# Altium schematic sheet DDR3 Memory_SO-DIMM.SchDoc
size A3
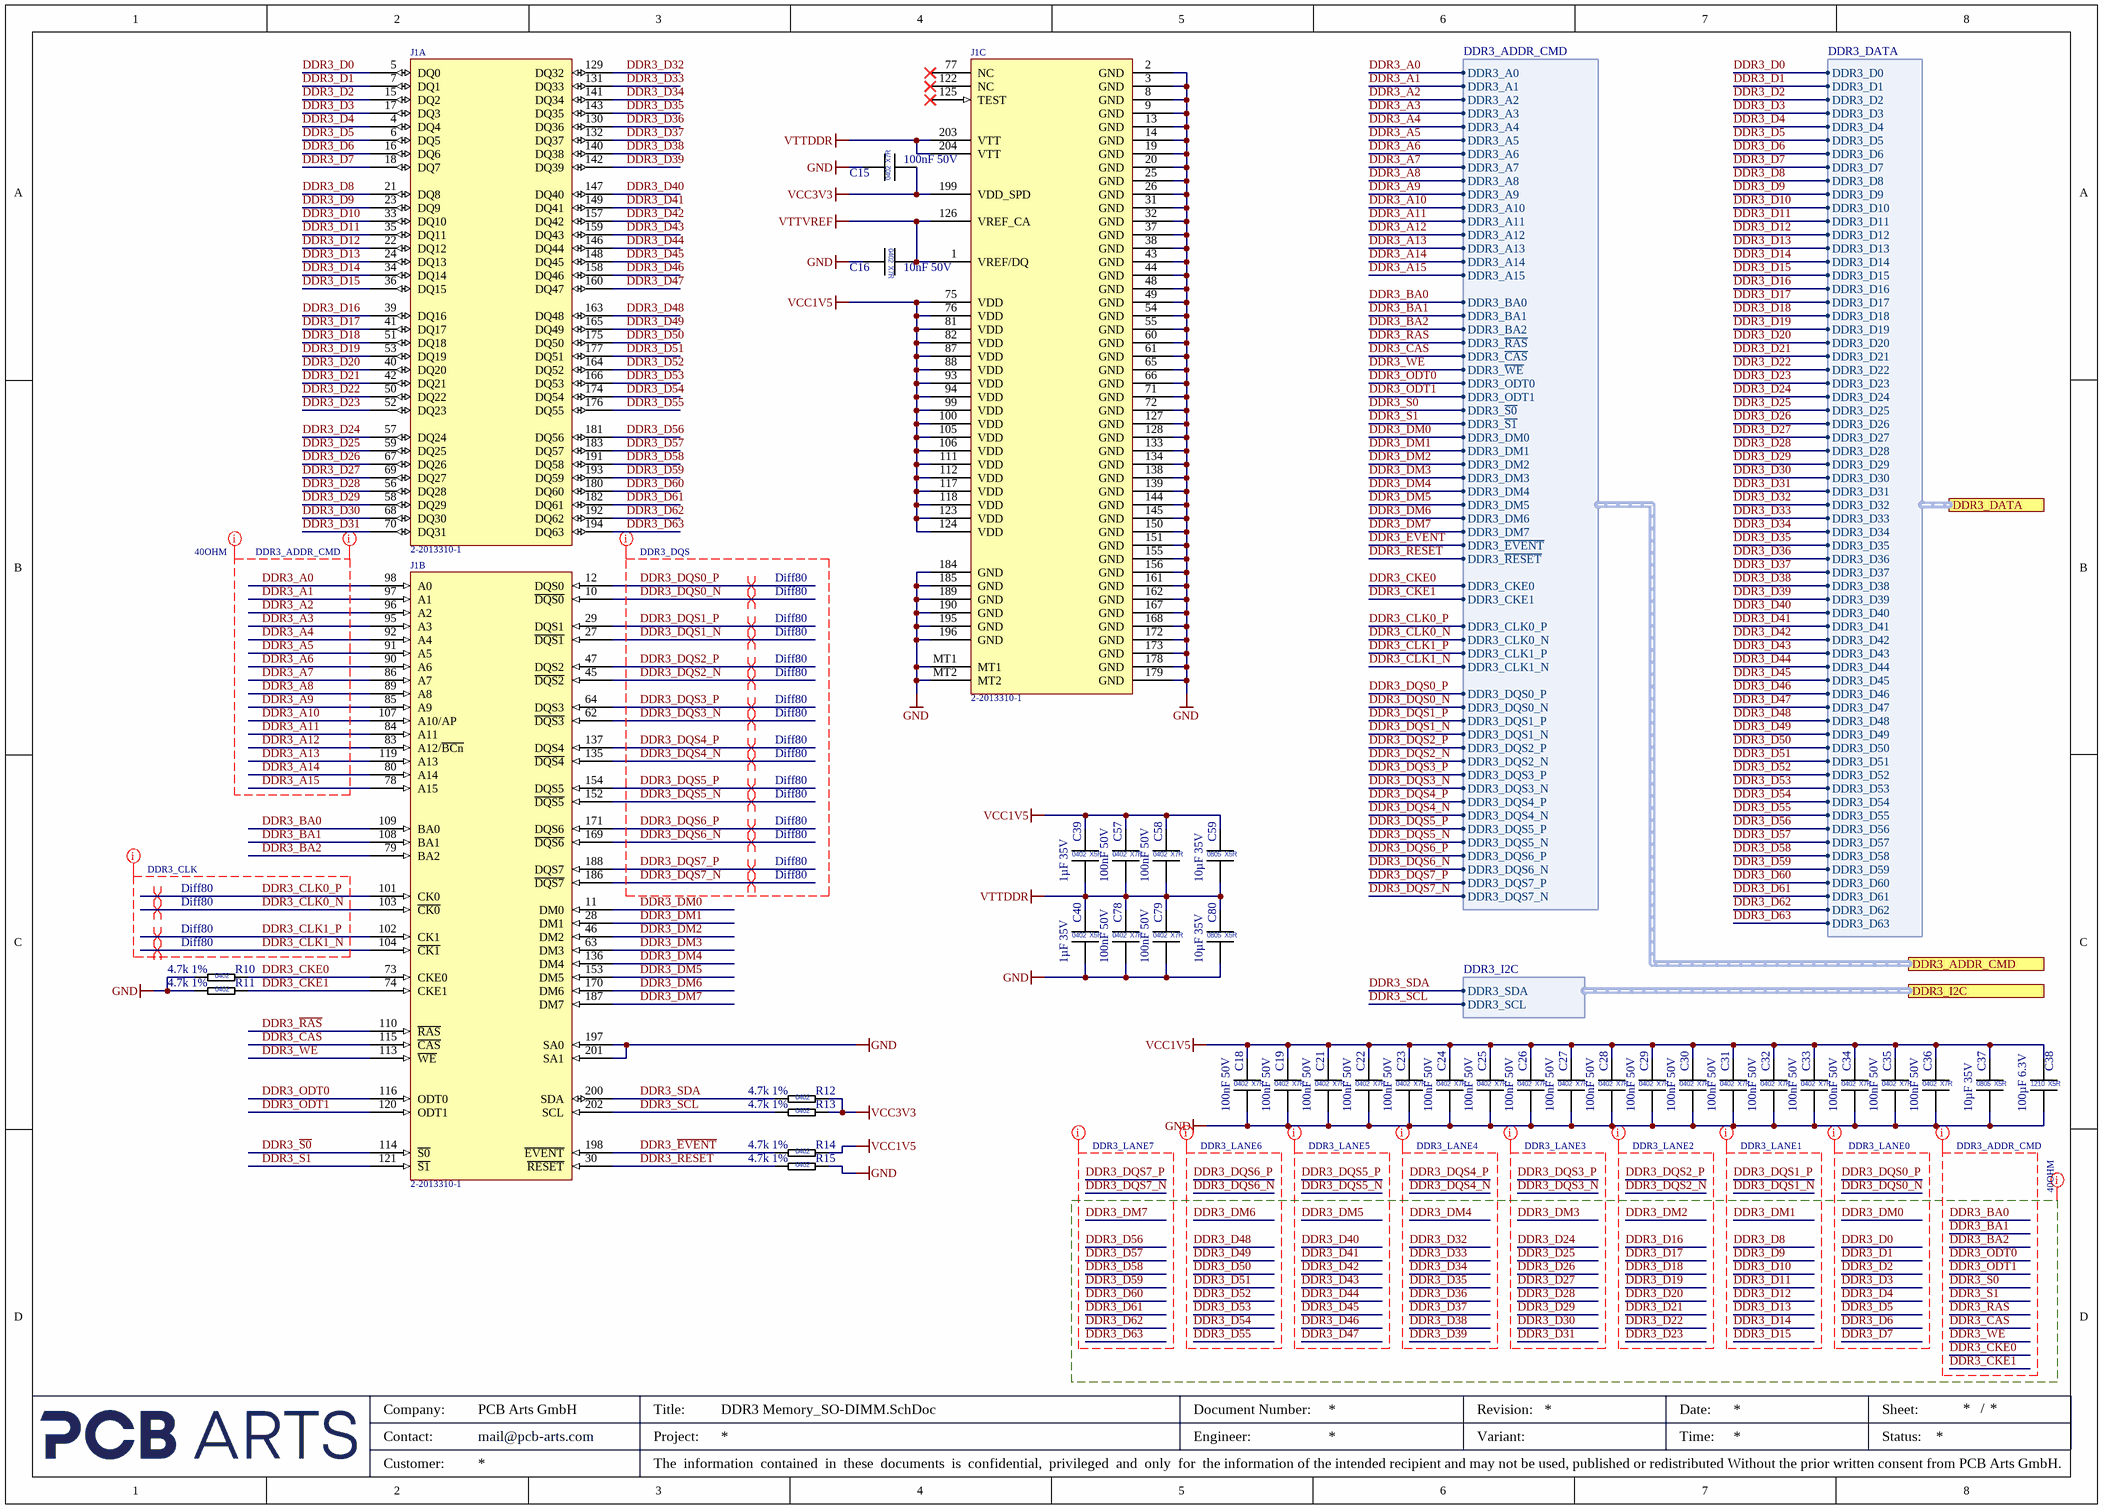
[diagram p0: DDR3 Memory_SO-DIMM.SchDoc]

## Parts
C15  100nF 50V  [CAP_0402_L]
C16  10nF 50V  [CAP_0402_L]
C18  100nF 50V  [CAP_0402_L]
C19  100nF 50V  [CAP_0402_L]
C21  100nF 50V  [CAP_0402_L]
C22  100nF 50V  [CAP_0402_L]
C23  100nF 50V  [CAP_0402_L]
C24  100nF 50V  [CAP_0402_L]
C25  100nF 50V  [CAP_0402_L]
C26  100nF 50V  [CAP_0402_L]
C27  100nF 50V  [CAP_0402_L]
C28  100nF 50V  [CAP_0402_L]
C29  100nF 50V  [CAP_0402_L]
C30  100nF 50V  [CAP_0402_L]
C31  100nF 50V  [CAP_0402_L]
C32  100nF 50V  [CAP_0402_L]
C33  100nF 50V  [CAP_0402_L]
C34  100nF 50V  [CAP_0402_L]
C35  100nF 50V  [CAP_0402_L]
C36  100nF 50V  [CAP_0402_L]
C37  10µF 35V  [CAP_0805]
C38  100µF 6.3V  [CAP_1210]
C39  1µF 35V  [CAP_0402_L]
C40  1µF 35V  [CAP_0402_L]
C57  100nF 50V  [CAP_0402_L]
C58  100nF 50V  [CAP_0402_L]
C59  10µF 35V  [CAP_0805]
C78  100nF 50V  [CAP_0402_L]
C79  100nF 50V  [CAP_0402_L]
C80  10µF 35V  [CAP_0805]
J1  2-2013310-1  [2-2013310-1]  (parts A,B,C of 3)
R10  4.7k 1%  [RES_0402_L]
R11  4.7k 1%  [RES_0402_L]
R12  4.7k 1%  [RES_0402_L]
R13  4.7k 1%  [RES_0402_L]
R14  4.7k 1%  [RES_0402_L]
R15  4.7k 1%  [RES_0402_L]

## Ports
DDR3_ADDR_CMD (harness DDR3_ADDR_CMD, see Top-Level-Sheet[6B], DDR3 Memory_Banks 32-33-34[8C]), DDR3_DATA (harness DDR3_DATA, see Top-Level-Sheet[6B], DDR3 Memory_Banks 32-33-34[8B]), DDR3_I2C (harness DDR3_I2C, see Top-Level-Sheet[6B], I2C Multiplexer[7A])

## Harnesses
DDR3_DATA: DDR3_D0, DDR3_D1, DDR3_D2, DDR3_D3, DDR3_D4, DDR3_D5, DDR3_D6, DDR3_D7, DDR3_D8, DDR3_D9, DDR3_D10, DDR3_D11, DDR3_D12, DDR3_D13, DDR3_D14, DDR3_D15, DDR3_D16, DDR3_D17, DDR3_D18, DDR3_D19, DDR3_D20, DDR3_D21, DDR3_D22, DDR3_D23, DDR3_D24, DDR3_D25, DDR3_D26, DDR3_D27, DDR3_D28, DDR3_D29, DDR3_D30, DDR3_D31, DDR3_D32, DDR3_D33, DDR3_D34, DDR3_D35, DDR3_D36, DDR3_D37, DDR3_D38, DDR3_D39, DDR3_D40, DDR3_D41, DDR3_D42, DDR3_D43, DDR3_D44, DDR3_D45, DDR3_D46, DDR3_D47, DDR3_D48, DDR3_D49, DDR3_D50, DDR3_D51, DDR3_D52, DDR3_D53, DDR3_D54, DDR3_D55, DDR3_D56, DDR3_D57, DDR3_D58, DDR3_D59, DDR3_D60, DDR3_D61, DDR3_D62, DDR3_D63
DDR3_ADDR_CMD: DDR3_A0, DDR3_BA0, DDR3_BA1, DDR3_BA2, DDR3_~{RAS}, DDR3_~{CAS}, DDR3_~{WE}, DDR3_ODT0, DDR3_ODT1, DDR3_~{S0}, DDR3_~{S1}, DDR3_DM0, DDR3_~{EVENT}, DDR3_~{RESET}, DDR3_CKE0, DDR3_CKE1, DDR3_CLK0_P, DDR3_CLK0_N, DDR3_CLK1_P, DDR3_CLK1_N, DDR3_DQS0_P, DDR3_DQS0_N, DDR3_DQS1_P, DDR3_DQS1_N, DDR3_DQS2_P, DDR3_DQS2_N, DDR3_DQS3_P, DDR3_DQS3_N, DDR3_DQS4_P, DDR3_DQS4_N, DDR3_DQS5_P, DDR3_DQS5_N, DDR3_DQS6_P, DDR3_DQS6_N, DDR3_DQS7_P, DDR3_DQS7_N, DDR3_A1, DDR3_A2, DDR3_A3, DDR3_A4, DDR3_A5, DDR3_A6, DDR3_A7, DDR3_A8, DDR3_A9, DDR3_A10, DDR3_A11, DDR3_A12, DDR3_A13, DDR3_A14, DDR3_A15, DDR3_DM1, DDR3_DM2, DDR3_DM3, DDR3_DM4, DDR3_DM5, DDR3_DM6, DDR3_DM7
DDR3_I2C: DDR3_SDA, DDR3_SCL

## Nets
GND: C15.1 C16.2 C18.2 C19.2 C21.2 C22.2 C23.2 C24.2 C25.2 C26.2 C27.2 C28.2 C29.2 C30.2 C31.2 C32.2 C33.2 C34.2 C35.2 C36.2 C37.2 C38.2 C40.2 C78.2 C79.2 C80.2 J1.2(GND) J1.3(GND) J1.8(GND) J1.9(GND) J1.13(GND) J1.14(GND) J1.19(GND) J1.20(GND) J1.25(GND) J1.26(GND) J1.31(GND) J1.32(GND) J1.37(GND) J1.38(GND) J1.43(GND) J1.44(GND) J1.48(GND) J1.49(GND) J1.54(GND) J1.55(GND) J1.60(GND) J1.61(GND) J1.65(GND) J1.66(GND) J1.71(GND) J1.72(GND) J1.127(GND) J1.128(GND) J1.133(GND) J1.134(GND) J1.138(GND) J1.139(GND) J1.144(GND) J1.145(GND) J1.150(GND) J1.151(GND) J1.155(GND) J1.156(GND) J1.161(GND) J1.162(GND) J1.167(GND) J1.168(GND) J1.172(GND) J1.173(GND) J1.178(GND) J1.179(GND) J1.184(GND) J1.185(GND) J1.189(GND) J1.190(GND) J1.195(GND) J1.196(GND) J1.197(SA0) J1.201(SA1) J1.MT1 J1.MT2 R10.1 R11.1 R15.2
VCC1V5: C18.1 C19.1 C21.1 C22.1 C23.1 C24.1 C25.1 C26.1 C27.1 C28.1 C29.1 C30.1 C31.1 C32.1 C33.1 C34.1 C35.1 C36.1 C37.1 C38.1 C39.1 C57.1 C58.1 C59.1 J1.75(VDD) J1.76(VDD) J1.81(VDD) J1.82(VDD) J1.87(VDD) J1.88(VDD) J1.93(VDD) J1.94(VDD) J1.99(VDD) J1.100(VDD) J1.105(VDD) J1.106(VDD) J1.111(VDD) J1.112(VDD) J1.117(VDD) J1.118(VDD) J1.123(VDD) J1.124(VDD) R14.2
VCC3V3: C15.2 J1.199(VDD_SPD) R12.2 R13.2
VTTDDR: C39.2 C40.1 C57.2 C58.2 C59.2 C78.1 C79.1 C80.1 J1.203(VTT) J1.204(VTT)
VTTVREF: C16.1 J1.1(VREF/DQ) J1.126(VREF_CA)
DDR3_A0: J1.98(A0) ; port DDR3_ADDR_CMD.DDR3_A0
DDR3_A1: J1.97(A1) ; port DDR3_ADDR_CMD.DDR3_A1
DDR3_A2: J1.96(A2) ; port DDR3_ADDR_CMD.DDR3_A2
DDR3_A3: J1.95(A3) ; port DDR3_ADDR_CMD.DDR3_A3
DDR3_A4: J1.92(A4) ; port DDR3_ADDR_CMD.DDR3_A4
DDR3_A5: J1.91(A5) ; port DDR3_ADDR_CMD.DDR3_A5
DDR3_A6: J1.90(A6) ; port DDR3_ADDR_CMD.DDR3_A6
DDR3_A7: J1.86(A7) ; port DDR3_ADDR_CMD.DDR3_A7
DDR3_A8: J1.89(A8) ; port DDR3_ADDR_CMD.DDR3_A8
DDR3_A9: J1.85(A9) ; port DDR3_ADDR_CMD.DDR3_A9
DDR3_A10: J1.107(A10/AP) ; port DDR3_ADDR_CMD.DDR3_A10
DDR3_A11: J1.84(A11) ; port DDR3_ADDR_CMD.DDR3_A11
DDR3_A12: J1.83(A12/~{BCn}) ; port DDR3_ADDR_CMD.DDR3_A12
DDR3_A13: J1.119(A13) ; port DDR3_ADDR_CMD.DDR3_A13
DDR3_A14: J1.80(A14) ; port DDR3_ADDR_CMD.DDR3_A14
DDR3_A15: J1.78(A15) ; port DDR3_ADDR_CMD.DDR3_A15
DDR3_BA0: J1.109(BA0) ; port DDR3_ADDR_CMD.DDR3_BA0
DDR3_BA1: J1.108(BA1) ; port DDR3_ADDR_CMD.DDR3_BA1
DDR3_BA2: J1.79(BA2) ; port DDR3_ADDR_CMD.DDR3_BA2
DDR3_~{CAS}: J1.115(~{CAS}) ; port DDR3_ADDR_CMD.DDR3_~{CAS}
DDR3_CKE0: J1.73(CKE0) R10.2 ; port DDR3_ADDR_CMD.DDR3_CKE0
DDR3_CKE1: J1.74(CKE1) R11.2 ; port DDR3_ADDR_CMD.DDR3_CKE1
DDR3_CLK0_N: J1.103(~{CK0}) ; port DDR3_ADDR_CMD.DDR3_CLK0_N
DDR3_CLK0_P: J1.101(CK0) ; port DDR3_ADDR_CMD.DDR3_CLK0_P
DDR3_CLK1_N: J1.104(~{CK1}) ; port DDR3_ADDR_CMD.DDR3_CLK1_N
DDR3_CLK1_P: J1.102(CK1) ; port DDR3_ADDR_CMD.DDR3_CLK1_P
DDR3_D0: J1.5(DQ0) ; port DDR3_DATA.DDR3_D0
DDR3_D1: J1.7(DQ1) ; port DDR3_DATA.DDR3_D1
DDR3_D2: J1.15(DQ2) ; port DDR3_DATA.DDR3_D2
DDR3_D3: J1.17(DQ3) ; port DDR3_DATA.DDR3_D3
DDR3_D4: J1.4(DQ4) ; port DDR3_DATA.DDR3_D4
DDR3_D5: J1.6(DQ5) ; port DDR3_DATA.DDR3_D5
DDR3_D6: J1.16(DQ6) ; port DDR3_DATA.DDR3_D6
DDR3_D7: J1.18(DQ7) ; port DDR3_DATA.DDR3_D7
DDR3_D8: J1.21(DQ8) ; port DDR3_DATA.DDR3_D8
DDR3_D9: J1.23(DQ9) ; port DDR3_DATA.DDR3_D9
DDR3_D10: J1.33(DQ10) ; port DDR3_DATA.DDR3_D10
DDR3_D11: J1.35(DQ11) ; port DDR3_DATA.DDR3_D11
DDR3_D12: J1.22(DQ12) ; port DDR3_DATA.DDR3_D12
DDR3_D13: J1.24(DQ13) ; port DDR3_DATA.DDR3_D13
DDR3_D14: J1.34(DQ14) ; port DDR3_DATA.DDR3_D14
DDR3_D15: J1.36(DQ15) ; port DDR3_DATA.DDR3_D15
DDR3_D16: J1.39(DQ16) ; port DDR3_DATA.DDR3_D16
DDR3_D17: J1.41(DQ17) ; port DDR3_DATA.DDR3_D17
DDR3_D18: J1.51(DQ18) ; port DDR3_DATA.DDR3_D18
DDR3_D19: J1.53(DQ19) ; port DDR3_DATA.DDR3_D19
DDR3_D20: J1.40(DQ20) ; port DDR3_DATA.DDR3_D20
DDR3_D21: J1.42(DQ21) ; port DDR3_DATA.DDR3_D21
DDR3_D22: J1.50(DQ22) ; port DDR3_DATA.DDR3_D22
DDR3_D23: J1.52(DQ23) ; port DDR3_DATA.DDR3_D23
DDR3_D24: J1.57(DQ24) ; port DDR3_DATA.DDR3_D24
DDR3_D25: J1.59(DQ25) ; port DDR3_DATA.DDR3_D25
DDR3_D26: J1.67(DQ26) ; port DDR3_DATA.DDR3_D26
DDR3_D27: J1.69(DQ27) ; port DDR3_DATA.DDR3_D27
DDR3_D28: J1.56(DQ28) ; port DDR3_DATA.DDR3_D28
DDR3_D29: J1.58(DQ29) ; port DDR3_DATA.DDR3_D29
DDR3_D30: J1.68(DQ30) ; port DDR3_DATA.DDR3_D30
DDR3_D31: J1.70(DQ31) ; port DDR3_DATA.DDR3_D31
DDR3_D32: J1.129(DQ32) ; port DDR3_DATA.DDR3_D32
DDR3_D33: J1.131(DQ33) ; port DDR3_DATA.DDR3_D33
DDR3_D34: J1.141(DQ34) ; port DDR3_DATA.DDR3_D34
DDR3_D35: J1.143(DQ35) ; port DDR3_DATA.DDR3_D35
DDR3_D36: J1.130(DQ36) ; port DDR3_DATA.DDR3_D36
DDR3_D37: J1.132(DQ37) ; port DDR3_DATA.DDR3_D37
DDR3_D38: J1.140(DQ38) ; port DDR3_DATA.DDR3_D38
DDR3_D39: J1.142(DQ39) ; port DDR3_DATA.DDR3_D39
DDR3_D40: J1.147(DQ40) ; port DDR3_DATA.DDR3_D40
DDR3_D41: J1.149(DQ41) ; port DDR3_DATA.DDR3_D41
DDR3_D42: J1.157(DQ42) ; port DDR3_DATA.DDR3_D42
DDR3_D43: J1.159(DQ43) ; port DDR3_DATA.DDR3_D43
DDR3_D44: J1.146(DQ44) ; port DDR3_DATA.DDR3_D44
DDR3_D45: J1.148(DQ45) ; port DDR3_DATA.DDR3_D45
DDR3_D46: J1.158(DQ46) ; port DDR3_DATA.DDR3_D46
DDR3_D47: J1.160(DQ47) ; port DDR3_DATA.DDR3_D47
DDR3_D48: J1.163(DQ48) ; port DDR3_DATA.DDR3_D48
DDR3_D49: J1.165(DQ49) ; port DDR3_DATA.DDR3_D49
DDR3_D50: J1.175(DQ50) ; port DDR3_DATA.DDR3_D50
DDR3_D51: J1.177(DQ51) ; port DDR3_DATA.DDR3_D51
DDR3_D52: J1.164(DQ52) ; port DDR3_DATA.DDR3_D52
DDR3_D53: J1.166(DQ53) ; port DDR3_DATA.DDR3_D53
DDR3_D54: J1.174(DQ54) ; port DDR3_DATA.DDR3_D54
DDR3_D55: J1.176(DQ55) ; port DDR3_DATA.DDR3_D55
DDR3_D56: J1.181(DQ56) ; port DDR3_DATA.DDR3_D56
DDR3_D57: J1.183(DQ57) ; port DDR3_DATA.DDR3_D57
DDR3_D58: J1.191(DQ58) ; port DDR3_DATA.DDR3_D58
DDR3_D59: J1.193(DQ59) ; port DDR3_DATA.DDR3_D59
DDR3_D60: J1.180(DQ60) ; port DDR3_DATA.DDR3_D60
DDR3_D61: J1.182(DQ61) ; port DDR3_DATA.DDR3_D61
DDR3_D62: J1.192(DQ62) ; port DDR3_DATA.DDR3_D62
DDR3_D63: J1.194(DQ63) ; port DDR3_DATA.DDR3_D63
DDR3_DM0: J1.11(DM0) ; port DDR3_ADDR_CMD.DDR3_DM0
DDR3_DM1: J1.28(DM1) ; port DDR3_ADDR_CMD.DDR3_DM1
DDR3_DM2: J1.46(DM2) ; port DDR3_ADDR_CMD.DDR3_DM2
DDR3_DM3: J1.63(DM3) ; port DDR3_ADDR_CMD.DDR3_DM3
DDR3_DM4: J1.136(DM4) ; port DDR3_ADDR_CMD.DDR3_DM4
DDR3_DM5: J1.153(DM5) ; port DDR3_ADDR_CMD.DDR3_DM5
DDR3_DM6: J1.170(DM6) ; port DDR3_ADDR_CMD.DDR3_DM6
DDR3_DM7: J1.187(DM7) ; port DDR3_ADDR_CMD.DDR3_DM7
DDR3_DQS0_N: J1.10(~{DQS0}) ; port DDR3_ADDR_CMD.DDR3_DQS0_N
DDR3_DQS0_P: J1.12(DQS0) ; port DDR3_ADDR_CMD.DDR3_DQS0_P
DDR3_DQS1_N: J1.27(~{DQS1}) ; port DDR3_ADDR_CMD.DDR3_DQS1_N
DDR3_DQS1_P: J1.29(DQS1) ; port DDR3_ADDR_CMD.DDR3_DQS1_P
DDR3_DQS2_N: J1.45(~{DQS2}) ; port DDR3_ADDR_CMD.DDR3_DQS2_N
DDR3_DQS2_P: J1.47(DQS2) ; port DDR3_ADDR_CMD.DDR3_DQS2_P
DDR3_DQS3_N: J1.62(~{DQS3}) ; port DDR3_ADDR_CMD.DDR3_DQS3_N
DDR3_DQS3_P: J1.64(DQS3) ; port DDR3_ADDR_CMD.DDR3_DQS3_P
DDR3_DQS4_N: J1.135(~{DQS4}) ; port DDR3_ADDR_CMD.DDR3_DQS4_N
DDR3_DQS4_P: J1.137(DQS4) ; port DDR3_ADDR_CMD.DDR3_DQS4_P
DDR3_DQS5_N: J1.152(~{DQS5}) ; port DDR3_ADDR_CMD.DDR3_DQS5_N
DDR3_DQS5_P: J1.154(DQS5) ; port DDR3_ADDR_CMD.DDR3_DQS5_P
DDR3_DQS6_N: J1.169(~{DQS6}) ; port DDR3_ADDR_CMD.DDR3_DQS6_N
DDR3_DQS6_P: J1.171(DQS6) ; port DDR3_ADDR_CMD.DDR3_DQS6_P
DDR3_DQS7_N: J1.186(~{DQS7}) ; port DDR3_ADDR_CMD.DDR3_DQS7_N
DDR3_DQS7_P: J1.188(DQS7) ; port DDR3_ADDR_CMD.DDR3_DQS7_P
DDR3_~{EVENT}: J1.198(~{EVENT}) R14.1 ; port DDR3_ADDR_CMD.DDR3_~{EVENT}
DDR3_ODT0: J1.116(ODT0) ; port DDR3_ADDR_CMD.DDR3_ODT0
DDR3_ODT1: J1.120(ODT1) ; port DDR3_ADDR_CMD.DDR3_ODT1
DDR3_~{RAS}: J1.110(~{RAS}) ; port DDR3_ADDR_CMD.DDR3_~{RAS}
DDR3_~{RESET}: J1.30(~{RESET}) R15.1 ; port DDR3_ADDR_CMD.DDR3_~{RESET}
DDR3_~{S0}: J1.114(~{S0}) ; port DDR3_ADDR_CMD.DDR3_~{S0}
DDR3_~{S1}: J1.121(~{S1}) ; port DDR3_ADDR_CMD.DDR3_~{S1}
DDR3_SCL: J1.202(SCL) R13.1 ; port DDR3_I2C.DDR3_SCL
DDR3_SDA: J1.200(SDA) R12.1 ; port DDR3_I2C.DDR3_SDA
DDR3_~{WE}: J1.113(~{WE}) ; port DDR3_ADDR_CMD.DDR3_~{WE}

Not connected (* = marked no-connect by the designer): J1 77(NC)* 122(NC)* 125(TEST)*

## Layout directives
differential pair; net class Diff80: DDR3_CLK0_N, DDR3_CLK0_P, DDR3_CLK1_N, DDR3_CLK1_P, DDR3_DQS0_N, DDR3_DQS0_P, DDR3_DQS1_N, DDR3_DQS1_P, DDR3_DQS2_N, DDR3_DQS2_P, DDR3_DQS3_N, DDR3_DQS3_P, DDR3_DQS4_N, DDR3_DQS4_P, DDR3_DQS5_N, DDR3_DQS5_P, DDR3_DQS6_N, DDR3_DQS6_P, DDR3_DQS7_N, DDR3_DQS7_P
net class DDR3_DQS: DDR3_DQS0_N, DDR3_DQS0_P, DDR3_DQS1_N, DDR3_DQS1_P, DDR3_DQS2_N, DDR3_DQS2_P, DDR3_DQS3_N, DDR3_DQS3_P, DDR3_DQS4_N, DDR3_DQS4_P, DDR3_DQS5_N, DDR3_DQS5_P, DDR3_DQS6_N, DDR3_DQS6_P, DDR3_DQS7_N, DDR3_DQS7_P
net class DDR3_LANE1: DDR3_D8, DDR3_D9, DDR3_D10, DDR3_D11, DDR3_D12, DDR3_D13, DDR3_D14, DDR3_D15, DDR3_DM1, DDR3_DQS1_N, DDR3_DQS1_P
net class DDR3_LANE2: DDR3_D16, DDR3_D17, DDR3_D18, DDR3_D19, DDR3_D20, DDR3_D21, DDR3_D22, DDR3_D23, DDR3_DM2, DDR3_DQS2_N, DDR3_DQS2_P
net class DDR3_LANE3: DDR3_D24, DDR3_D25, DDR3_D26, DDR3_D27, DDR3_D28, DDR3_D29, DDR3_D30, DDR3_D31, DDR3_DM3, DDR3_DQS3_N, DDR3_DQS3_P
net class DDR3_LANE4: DDR3_D32, DDR3_D33, DDR3_D34, DDR3_D35, DDR3_D36, DDR3_D37, DDR3_D38, DDR3_D39, DDR3_DM4, DDR3_DQS4_N, DDR3_DQS4_P
net class DDR3_LANE5: DDR3_D40, DDR3_D41, DDR3_D42, DDR3_D43, DDR3_D44, DDR3_D45, DDR3_D46, DDR3_D47, DDR3_DM5, DDR3_DQS5_N, DDR3_DQS5_P
net class DDR3_LANE6: DDR3_D48, DDR3_D49, DDR3_D50, DDR3_D51, DDR3_D52, DDR3_D53, DDR3_D54, DDR3_D55, DDR3_DM6, DDR3_DQS6_N, DDR3_DQS6_P
net class DDR3_LANE7: DDR3_D56, DDR3_D57, DDR3_D58, DDR3_D59, DDR3_D60, DDR3_D61, DDR3_D62, DDR3_D63, DDR3_DM7, DDR3_DQS7_N, DDR3_DQS7_P
net class 40OHM: DDR3_A0, DDR3_A1, DDR3_A2, DDR3_A3, DDR3_A4, DDR3_A5, DDR3_A6, DDR3_A7, DDR3_A8, DDR3_A9, DDR3_A10, DDR3_A11, DDR3_A12, DDR3_A13, DDR3_A14, DDR3_A15, DDR3_BA0, DDR3_BA1, DDR3_BA2, DDR3_CKE0, DDR3_CKE1, DDR3_D0, DDR3_D1, DDR3_D2, DDR3_D3, DDR3_D4, DDR3_D5, DDR3_D6, DDR3_D7, DDR3_D8, DDR3_D9, DDR3_D10, DDR3_D11, DDR3_D12, DDR3_D13, DDR3_D14, DDR3_D15, DDR3_D16, DDR3_D17, DDR3_D18, DDR3_D19, DDR3_D20, DDR3_D21, DDR3_D22, DDR3_D23, DDR3_D24, DDR3_D25, DDR3_D26, DDR3_D27, DDR3_D28, DDR3_D29, DDR3_D30, DDR3_D31, DDR3_D32, DDR3_D33, DDR3_D34, DDR3_D35, DDR3_D36, DDR3_D37, DDR3_D38, DDR3_D39, DDR3_D40, DDR3_D41, DDR3_D42, DDR3_D43, DDR3_D44, DDR3_D45, DDR3_D46, DDR3_D47, DDR3_D48, DDR3_D49, DDR3_D50, DDR3_D51, DDR3_D52, DDR3_D53, DDR3_D54, DDR3_D55, DDR3_D56, DDR3_D57, DDR3_D58, DDR3_D59, DDR3_D60, DDR3_D61, DDR3_D62, DDR3_D63, DDR3_DM0, DDR3_DM1, DDR3_DM2, DDR3_DM3, DDR3_DM4, DDR3_DM5, DDR3_DM6, DDR3_DM7, DDR3_ODT0, DDR3_ODT1, DDR3_~{CAS}, DDR3_~{RAS}, DDR3_~{S0}, DDR3_~{S1}, DDR3_~{WE}
net class DDR3_ADDR_CMD: DDR3_A0, DDR3_A1, DDR3_A2, DDR3_A3, DDR3_A4, DDR3_A5, DDR3_A6, DDR3_A7, DDR3_A8, DDR3_A9, DDR3_A10, DDR3_A11, DDR3_A12, DDR3_A13, DDR3_A14, DDR3_A15, DDR3_BA0, DDR3_BA1, DDR3_BA2, DDR3_CKE0, DDR3_CKE1, DDR3_ODT0, DDR3_ODT1, DDR3_~{CAS}, DDR3_~{RAS}, DDR3_~{S0}, DDR3_~{S1}, DDR3_~{WE}
net class DDR3_CLK: DDR3_CLK0_N, DDR3_CLK0_P, DDR3_CLK1_N, DDR3_CLK1_P
net class DDR3_LANE0: DDR3_D0, DDR3_D1, DDR3_D2, DDR3_D3, DDR3_D4, DDR3_D5, DDR3_D6, DDR3_D7, DDR3_DM0, DDR3_DQS0_N, DDR3_DQS0_P

## Notes on the sheet
- Company:
- Contact:
- Customer:
- mail@pcb-arts.com
- PCB Arts GmbH
- Title:
- Project:
- The  information  contained  in  these  documents  is  confidential,  privileged  and  only  for  the information of the intended recipient and may not be used, published or redistributed Without the prior written consent from PCB Arts GmbH.
- Engineer:
- Document Number:
- Revision:
- Variant:
- Date:
- Time:
- Sheet:
- Status:
- /
- (in symbol CAP_0402_1µF_35V) 0402; X5R
- (in symbol CAP_0402_10nF_50V) 0402; X7R
- (in symbol CAP_0402_100nF_50V) 0402; X7R
- (in symbol CAP_0805_10µF_35V) 0805; X5R
- (in symbol CAP_1210_100µF_6.3V) 1210; X5R
- (in symbol RES_0402_4.7k_1%) 0402

## Library data of the parts
C15 C18 C19 C21-C36 C57 C58 C78 C79 = CAP_0402_100nF_50V: Multilayer Ceramic Capacitors MLCC - SMD/SMT 0402 50VDC; Manufacturer 1: Murata Electronics; Manufacturer 1 Prt. Nr.: GCM155L8EH104KE07D; Manufacturer 2 Prt. Nr.: UMK105B7104KV-FR; Manufacturer 2: TDK
C16 = CAP_0402_10nF_50V: Multilayer Ceramic Capacitors MLCC - SMD/SMT 0402 50VDC; Manufacturer 1: Wurth Elektronik; Manufacturer 1 Prt. Nr.: 885012205067; Manufacturer 2 Prt. Nr.: AC0402KPX7R9BB103; Manufacturer 2: Yageo
C37 C59 C80 = CAP_0805_10µF_35V: Multilayer Ceramic Capacitors MLCC - SMD/SMT 0805 35VDC; Manufacturer 1: Murata Electronics; Manufacturer 1 Prt. Nr.: GRM21BR6YA106ME43L; Manufacturer 2 Prt. Nr.: C2012X5R1V106M085AC; Manufacturer 2: TDK
C38 = CAP_1210_100µF_6.3V: Multilayer Ceramic Capacitors MLCC - SMD/SMT 1210 6.3VDC; Manufacturer 1: Samsung Electro-Mechanics; Manufacturer 1 Prt. Nr.: CL32A107MQVNNWE; Manufacturer 2 Prt. Nr.: JMK325ABJ107MMHP; Manufacturer 2: Taiyo Yuden
C39 C40 = CAP_0402_1µF_35V: Multilayer Ceramic Capacitors MLCC - SMD/SMT 0402 35VDC; Manufacturer 1: Kyocera Electronic Components; Manufacturer 1 Prt. Nr.: CM05X5R105K35AH; Manufacturer 2 Prt. Nr.: C1005X5R1V105K050BC; Manufacturer 2: TDK
J1 = 2-2013310-1_SO-DIMM DDR3 204P 9.2H STD Connector: SO-DIMM DDR3 204P 9.2H STD Connector; Manufacturer 1: TE Connectivity; Manufacturer 1 Prt. Nr.: 2-2013310-1
R10-R15 = RES_0402_4.7k_1%: Thick Film Resistors - SMD 4.7kOhm 1%; Manufacturer 1: Vishay / Dale; Manufacturer 1 Prt. Nr.: CRCW04024K70FKEDC; Manufacturer 2 Prt. Nr.: RC0402FR-134K7L; Manufacturer 2: Yageo